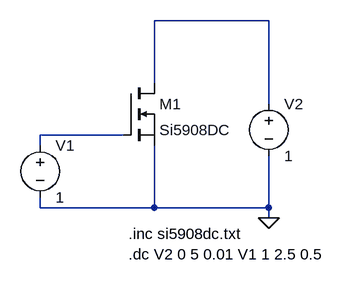
[diagram p0: schematic Fig_10-9_si5908dc.asc]
Fig_10-9_si5908dc.asc, the LTspice schematic file:
Version 4
SHEET 1 880 680
WIRE 320 16 144 16
WIRE 144 112 144 16
WIRE 320 144 320 16
WIRE 96 192 -32 192
WIRE -32 208 -32 192
WIRE -32 304 -32 288
WIRE 144 304 144 208
WIRE 144 304 -32 304
WIRE 320 304 320 224
WIRE 320 304 144 304
WIRE 320 320 320 304
FLAG 320 320 0
SYMBOL voltage -32 192 R0
WINDOW 123 0 0 Left 2
WINDOW 39 0 0 Left 2
SYMATTR InstName V1
SYMATTR Value 1
SYMBOL voltage 320 128 R0
WINDOW 123 0 0 Left 2
WINDOW 39 0 0 Left 2
SYMATTR InstName V2
SYMATTR Value 1
SYMBOL nmos 96 112 R0
SYMATTR InstName M1
SYMATTR Value Si5908DC
SYMATTR Prefix x
TEXT 104 344 Left 2 !.inc si5908dc.txt
TEXT 104 376 Left 2 !.dc V2 0 5 0.01 V1 1 2.5 0.5

The netlist it stands for:
* Fig_10-9_si5908dc.asc
V1 N002 0 1
V2 N001 0 1
XM1 N001 N002 0 Si5908DC  ; pins D G S
.inc si5908dc.txt
.dc V2 0 5 0.01 V1 1 2.5 0.5
.backanno
.end